# EAGLE design DICO_giangrandi_flipped_v100 (EAGLE 6.6.0)
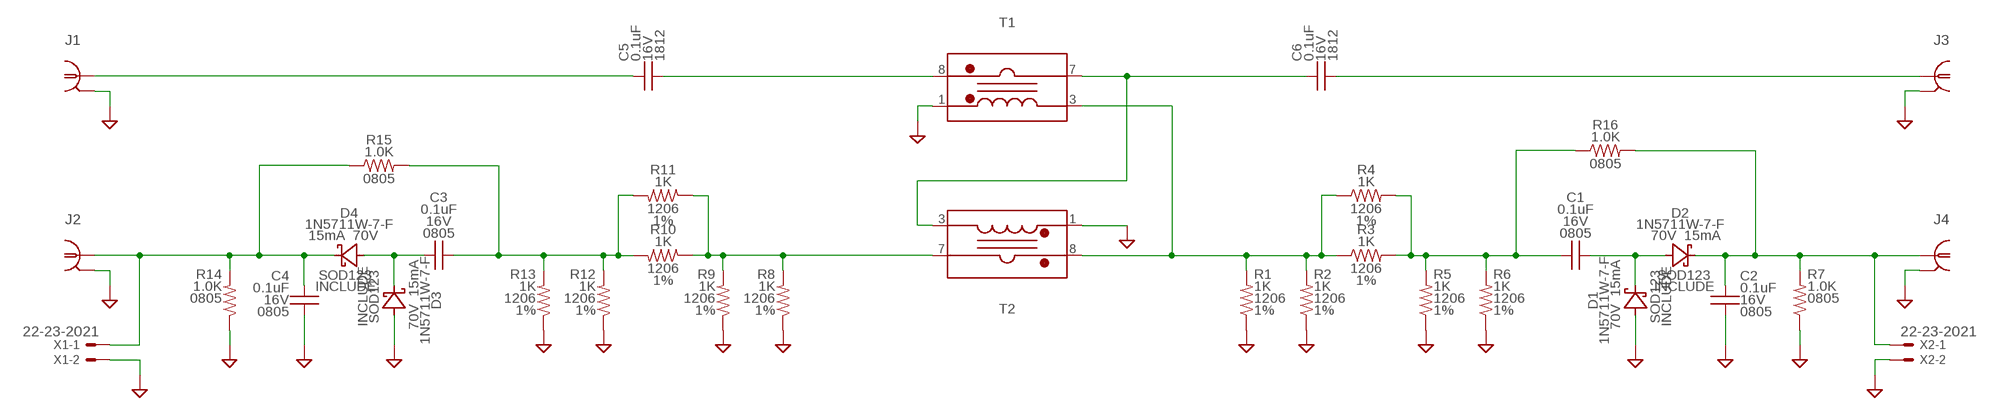
[diagram p0: schematic, sheet 1]

## Parts
C1  0.1uF  CC-0.1U-16V-0805-X7R0805_IPC  [0805_IPC-7351B]
C2  0.1uF  CC-0.1U-16V-0805-X7R0805_IPC  [0805_IPC-7351B]
C3  0.1uF  CC-0.1U-16V-0805-X7R0805_IPC  [0805_IPC-7351B]
C4  0.1uF  CC-0.1U-16V-0805-X7R0805_IPC  [0805_IPC-7351B]
C5  0.1uF  CC1812  [C1812]
C6  0.1uF  CC1812  [C1812]
D1  D-SCHOTTKY1N5711W-7-FSOD123  [SOD123]
D2  D-SCHOTTKY1N5711W-7-FSOD123  [SOD123]
D3  D-SCHOTTKY1N5711W-7-FSOD123  [SOD123]
D4  D-SCHOTTKY1N5711W-7-FSOD123  [SOD123]
J1  COAXSMA_0.375WIDE  [SMA_EDGE_0.375WIDE]
J2  COAXSMA_0.375WIDE  [SMA_EDGE_0.375WIDE]
J3  COAXSMA_0.375WIDE  [SMA_EDGE_0.375WIDE]
J4  COAXSMA_0.375WIDE  [SMA_EDGE_0.375WIDE]
R1  1K  RR-1.0K-1%-1206-0.25W1206_IPC  [1206_IPC-7351B]
R2  1K  RR-1.0K-1%-1206-0.25W1206_IPC  [1206_IPC-7351B]
R3  1K  R90R-1.0K-1%-1206-0.25W1206_IPC  [1206_IPC-7351B]
R4  1K  R90R-1.0K-1%-1206-0.25W1206_IPC  [1206_IPC-7351B]
R5  1K  RR-1.0K-1%-1206-0.25W1206_IPC  [1206_IPC-7351B]
R6  1K  RR-1.0K-1%-1206-0.25W1206_IPC  [1206_IPC-7351B]
R7  1.0K  RR-1.0K-0.1%-0805-0.1W0805_IPC  [0805_IPC-7351B]
R8  1K  RR-1.0K-1%-1206-0.25W1206_IPC  [1206_IPC-7351B]
R9  1K  RR-1.0K-1%-1206-0.25W1206_IPC  [1206_IPC-7351B]
R10  1K  R90R-1.0K-1%-1206-0.25W1206_IPC  [1206_IPC-7351B]
R11  1K  R90R-1.0K-1%-1206-0.25W1206_IPC  [1206_IPC-7351B]
R12  1K  RR-1.0K-1%-1206-0.25W1206_IPC  [1206_IPC-7351B]
R13  1K  RR-1.0K-1%-1206-0.25W1206_IPC  [1206_IPC-7351B]
R14  1.0K  RR-1.0K-0.1%-0805-0.1W0805_IPC  [0805_IPC-7351B]
R15  1.0K  R90R-1.0K-0.1%-0805-0.1W0805_IPC  [0805_IPC-7351B]
R16  1.0K  R90R-1.0K-0.1%-0805-0.1W0805_IPC  [0805_IPC-7351B]
T1  TRAFO_CURRENTSENSEPA1005_NOCENTERPADS  [PA1005_NOCENTERPADS]
T2  TRAFO_CURRENTSENSEPA1005_NOCENTERPADS  [PA1005_NOCENTERPADS]
X1  22-23-2021  [22-23-2021]
X2  22-23-2021  [22-23-2021]

## Nets
GND: C2.2 C4.2 D1.A(A1) D3.A(A1) J1.S1(GND1) J1.S2(GND1) J1.S3(GND1) J1.S4(GND1) J2.S1(GND1) J2.S2(GND1) J2.S3(GND1) J2.S4(GND1) J3.S1(GND1) J3.S2(GND1) J3.S3(GND1) J3.S4(GND1) J4.S1(GND1) J4.S2(GND1) J4.S3(GND1) J4.S4(GND1) R1.2 R2.2 R5.2 R6.2 R7.2 R8.2 R9.2 R12.2 R13.2 R14.2 T1.1(SS) T2.1(SS) X1.2 X2.2
N$1: R8.1 R9.1 R10.1 R11.1 T2.7(PF)
N$2: C5.2 T1.8(PS)
N$4: C5.1 J1.C
N$5: C1.1 R3.2 R4.2 R5.1 R6.1 R16.1
N$6: C1.2 D1.K(C1) D2.A(A1)
N$7: C2.1 D2.K(C1) J4.C R7.1 R16.2 X2.1
N$9: C3.1 R10.2 R11.2 R12.1 R13.1 R15.2
N$10: C3.2 D3.K(C1) D4.A(A1)
N$11: C4.1 D4.K(C1) J2.C R14.1 R15.1 X1.1
N$12: C6.2 J3.C
N$13: R1.1 R2.1 R3.1 R4.1 T1.3(SF) T2.8(PS)
N$14: C6.1 T1.7(PF) T2.3(SF)

## Library data of the parts
C1-C4 = MDT_C:C; PACKAGE: 0805; VOLTAGE: 16V
C5 C6 = MDT_C:C; PACKAGE: 1812; VOLTAGE: 16V
D1-D4 = MDT_Diode:D-SCHOTTKY; BOM: INCLUDE; CURRENT: 15mA; DEVICE: 1N5711W-7-F; PACKAGE: SOD123; PARTNO: 1N5711W-7-F; VOLTAGE: 70V
J1-J4 = MDT_CON:COAX; BOM: INCLUDE
R1 R2 R5 R6 R8 R9 R12 R13 = MDT_R:R; PACKAGE: 1206; POWER: 0.25; TOL: 1%
R3 R4 R10 R11 = MDT_R:R90; PACKAGE: 1206; POWER: 0.25; TOL: 1%
R7 R14 = MDT_R:R; PACKAGE: 0805
R15 R16 = MDT_R:R90; PACKAGE: 0805
T1 T2 = MDT_TRAFO:TRAFO_CURRENTSENSE
X1 X2 = con-molex:22-23-2021: .100" (2.54mm) Center Header - 2 Pin; MF: MOLEX; MPN: 22-23-2021; OC_FARNELL: 1462926; OC_NEWARK: 25C3832

## Board
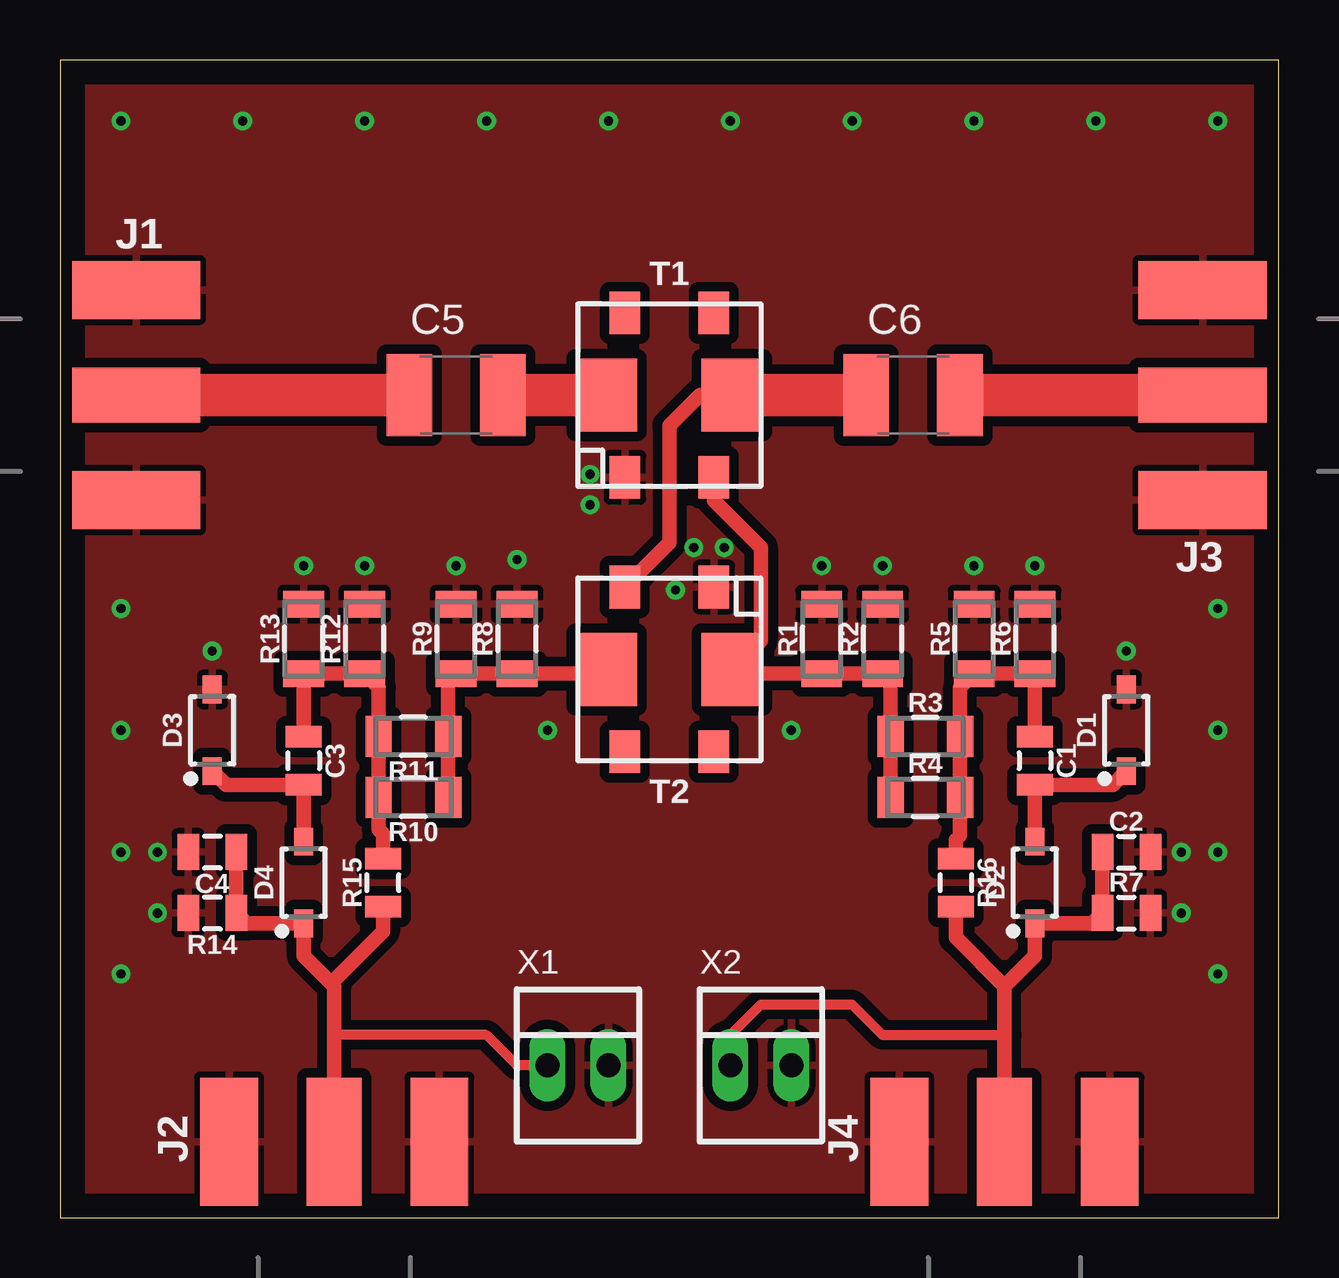
[diagram p1: board, top side]
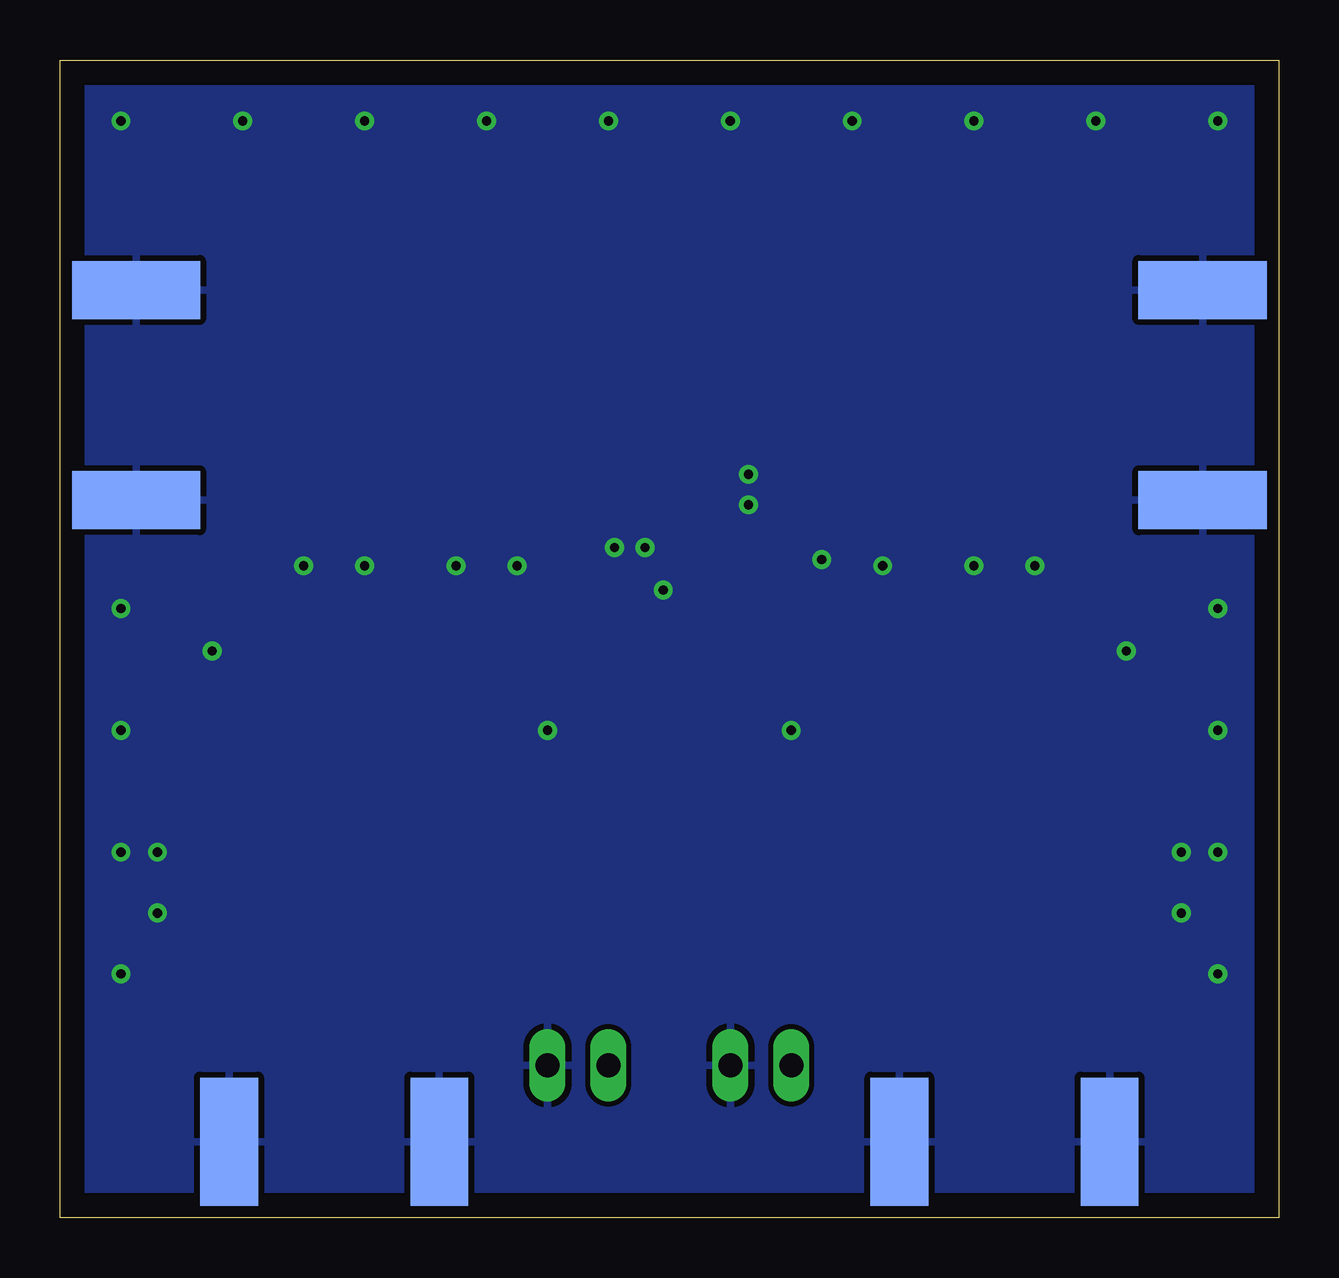
[diagram p2: board, bottom side, seen from below]

Size 50.8 x 48.26 mm. Coordinates in mm from the lower left corner, seen from the top.
Outline: 0,0 50.8,0 50.8,48.26 0,48.26 0,0
Copper layers (1*16): Top 0.035mm / dielectric 1.5mm / Bottom 0.035mm
Design rules "default": minimum track width 10mil, minimum drill 24mil, track to track 8mil, track to pad 8mil, pad to pad 8mil, via to via 8mil, smd to smd 8mil, copper to edge 40mil, drill to drill 8mil, minimum pad ring 10mil, minimum via ring 8mil, stop-mask expansion 4mil, vias tented up to drill 0mil, thermal gap 10mil

### Footprints (pad centres in the part's own frame; a part is rotated, then mirrored left to right if it is on the bottom)
0805_IPC-7351B = smd 0.9 x 1.5: 1 -1,0; 2 1,0
C1812 = smd 1.9 x 3.4: 1 -1.95,0; 2 1.95,0
SOD123 = smd 1.15 x 0.8: A 1.7,0; K -1.7,0
SMA_EDGE_0.375WIDE = smd 5.334 x 2.286: C 3.175,0 | smd 5.334 x 2.413: S1 3.175,4.381; S2 3.175,-4.381 | smd 5.334 x 2.413 bottom: S3 3.175,4.381; S4 3.175,-4.381
1206_IPC-7351B = smd 1.1 x 1.7: 1 -1.45,0; 2 1.45,0
PA1005_NOCENTERPADS = smd 1.27 x 1.778: 1 -1.854,-3.429; 3 1.854,-3.429; 4 1.854,3.429; 6 -1.854,3.429 | smd 2.54 x 3.048: 7 2.616,0; 8 -2.616,0
22-23-2021 = drill 1 long: 1 -1.27,0; 2 1.27,0

### Placement (x,y rotation side)
C1  40.64,19.05 270 top
C2  44.45,15.24 0 top
C3  10.16,19.05 270 top
C4  6.35,15.24 180 top
C5  16.51,34.29 0 top
C6  35.56,34.29 0 top
D1  44.45,20.32 90 top
D2  40.64,13.97 90 top
D3  6.35,20.32 90 top
D4  10.16,13.97 90 top
J1  0,34.29 0 top
J2  11.43,0 90 top
J3  50.8,34.29 180 top
J4  39.37,0 90 top
R1  31.75,24.13 90 top
R2  34.29,24.13 90 top
R3  36.07,20.07 0 top
R4  36.07,17.53 0 top
R5  38.1,24.13 90 top
R6  40.64,24.13 90 top
R7  44.45,12.7 0 top
R8  19.05,24.13 90 top
R9  16.51,24.13 90 top
R10  14.73,17.53 180 top
R11  14.73,20.07 180 top
R12  12.7,24.13 90 top
R13  10.16,24.13 90 top
R14  6.35,12.7 180 top
R15  13.46,13.97 90 top
R16  37.34,13.97 270 top
T1  25.4,34.29 0 top
T2  25.4,22.86 180 top
X1  21.59,6.35 0 top
X2  29.21,6.35 0 top

### Tracks (layer width: path | path; a pad name or v marks a point on that pad's centre or on a via)
GND  (via drill 0.38)
  other vias: 19.05,27.43 2.54,45.72 7.62,45.72 12.7,45.72 17.78,45.72 22.86,45.72 27.94,45.72 33.02,45.72 38.1,45.72 43.18,45.72 48.26,45.72 2.54,25.4 2.54,20.32 2.54,15.24 2.54,10.16 48.26,25.4 48.26,20.32 48.26,15.24 48.26,10.16 16.51,27.18 12.7,27.18 10.16,27.18 6.35,23.62 4.06,15.24 4.06,12.7 46.74,12.7 46.74,15.24 44.45,23.62 40.64,27.18 38.1,27.18 34.29,27.18 31.75,27.18 26.42,27.94 27.69,27.94 22.1,30.99 22.1,29.72 25.65,26.16 20.32,20.32 30.48,20.32
  pour Top (isolate 0.406): 0.51,47.75 50.29,47.75 50.29,0.51 0.51,0.51
  pour Bottom: 0.51,47.75 50.29,47.75 50.29,0.51 0.51,0.51
N$1
  Top 0.61: T2.7 22.6,22.68 R8.1 R9.1 16.18,22.35 R11.1 R10.1
N$2
  Top 1.778: T1.8 C5.2
N$4
  Top 1.778: C5.1 J1.C
N$5
  Top 0.61: C1.1 R6.1 R5.1 37.52,22.1 R3.2 R4.2 37.52,15.93 37.34,15.75 R16.1
N$6
  Top 0.61: D2.A C1.2 43.88,18.05 D1.K
N$7
  Top 0.406: X2.1 27.94,7.62 29.21,8.89 33.02,8.89 34.29,7.62 39.37,7.62
  Top 0.61: C2.1 R7.1 43.02,12.27 D2.K 40.64,10.92 39.37,9.65 | J4.C 39.37,7.62 39.37,9.65 | 39.37,9.65 37.34,11.68 R16.2
N$9
  Top 0.61: C3.1 R13.1 R12.1 13.28,22.1 R11.2 R10.2 13.28,16.18 13.46,16 R15.2
N$10
  Top 0.61: D4.A C3.2 6.92,18.05 D3.K
N$11
  Top 0.406: X1.1 19.05,6.35 17.78,7.62 11.43,7.62
  Top 0.61: C4.1 R14.1 7.78,12.27 D4.K 10.16,10.92 11.3,9.78 | J2.C 11.43,7.62 11.43,9.65 11.3,9.78 | R15.1 13.46,11.94 11.3,9.78
N$12
  Top 1.778: C6.2 J3.C
N$13
  Top 0.61: T1.3 27.25,29.9 29.21,27.94 29.21,24.05 T2.8 28.2,22.68 R1.1 R2.1 34.62,22.35 R3.1 R4.1
N$14
  Top 0.61: T1.7 26.67,34.29 25.4,33.02 25.4,28.14 T2.3
  Top 1.778: T1.7 C6.1